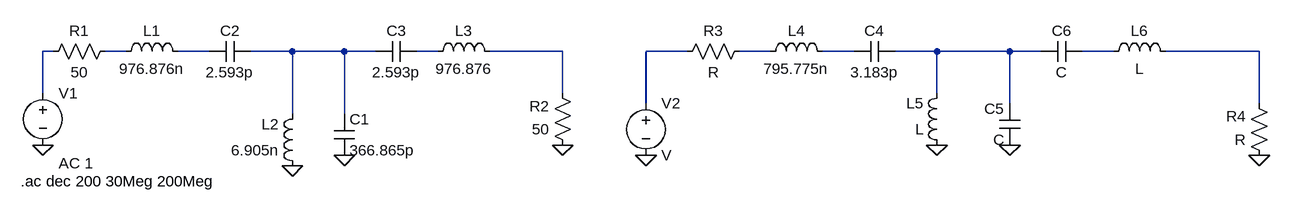
[diagram p0: schematic Draft8.asc]
Draft8.asc, the LTspice schematic file:
Version 4
SHEET 1 1748 680
WIRE -128 128 -144 128
WIRE -16 128 -48 128
WIRE 112 128 64 128
WIRE 240 128 176 128
WIRE 320 128 240 128
WIRE 368 128 320 128
WIRE 464 128 432 128
WIRE 656 128 544 128
WIRE 848 128 784 128
WIRE 976 128 928 128
WIRE 1104 128 1056 128
WIRE 1232 128 1168 128
WIRE 1344 128 1232 128
WIRE 1392 128 1344 128
WIRE 1504 128 1456 128
WIRE 1728 128 1584 128
WIRE -144 192 -144 128
WIRE 656 192 656 128
WIRE 1232 192 1232 128
WIRE 784 208 784 128
WIRE 1344 208 1344 128
WIRE 1728 208 1728 128
WIRE 240 224 240 128
WIRE 320 224 320 128
FLAG 240 304 0
FLAG 320 288 0
FLAG 656 272 0
FLAG -144 272 0
FLAG 784 288 0
FLAG 1232 272 0
FLAG 1344 272 0
FLAG 1728 288 0
SYMBOL ind -32 144 R270
WINDOW 0 32 56 VTop 2
WINDOW 3 5 56 VBottom 2
SYMATTR InstName L1
SYMATTR Value 976.876n
SYMBOL ind 256 320 R180
WINDOW 0 36 80 Left 2
WINDOW 3 36 40 Left 2
SYMATTR InstName L2
SYMATTR Value 6.905n
SYMBOL ind 448 144 R270
WINDOW 0 32 56 VTop 2
WINDOW 3 5 56 VBottom 2
SYMATTR InstName L3
SYMATTR Value 976.876
SYMBOL cap 304 224 R0
SYMATTR InstName C1
SYMATTR Value 366.865p
SYMBOL cap 176 112 R90
WINDOW 0 0 32 VBottom 2
WINDOW 3 32 32 VTop 2
SYMATTR InstName C2
SYMATTR Value 2.593p
SYMBOL cap 432 112 R90
WINDOW 0 0 32 VBottom 2
WINDOW 3 32 32 VTop 2
SYMATTR InstName C3
SYMATTR Value 2.593p
SYMBOL voltage -144 176 R0
WINDOW 123 24 124 Left 2
WINDOW 39 0 0 Left 0
SYMATTR InstName V1
SYMATTR Value ""
SYMATTR Value2 AC 1
SYMBOL res -32 112 R90
WINDOW 0 0 56 VBottom 2
WINDOW 3 32 56 VTop 2
SYMATTR InstName R1
SYMATTR Value 50
SYMBOL res 672 288 R180
WINDOW 0 36 76 Left 2
WINDOW 3 36 40 Left 2
SYMATTR InstName R2
SYMATTR Value 50
SYMBOL res 944 112 R90
WINDOW 0 0 56 VBottom 2
WINDOW 3 32 56 VTop 2
SYMATTR InstName R3
SYMBOL res 1744 304 R180
WINDOW 0 36 76 Left 2
WINDOW 3 36 40 Left 2
SYMATTR InstName R4
SYMBOL cap 1168 112 R90
WINDOW 0 0 32 VBottom 2
WINDOW 3 32 32 VTop 2
SYMATTR InstName C4
SYMATTR Value 3.183p
SYMBOL cap 1360 272 R180
WINDOW 0 24 56 Left 2
WINDOW 3 24 8 Left 2
SYMATTR InstName C5
SYMBOL cap 1392 144 R270
WINDOW 0 32 32 VTop 2
WINDOW 3 0 32 VBottom 2
SYMATTR InstName C6
SYMBOL ind 960 144 R270
WINDOW 0 32 56 VTop 2
WINDOW 3 5 56 VBottom 2
SYMATTR InstName L4
SYMATTR Value 795.775n
SYMBOL ind 1248 288 R180
WINDOW 0 36 80 Left 2
WINDOW 3 36 40 Left 2
SYMATTR InstName L5
SYMBOL ind 1488 144 R270
WINDOW 0 32 56 VTop 2
WINDOW 3 5 56 VBottom 2
SYMATTR InstName L6
SYMBOL voltage 784 192 R0
SYMATTR InstName V2
TEXT -178 328 Left 2 !.ac dec 200 30Meg 200Meg

The netlist it stands for:
* Draft8.asc
L1 N002 N003 976.876n
L2 0 N004 6.905n
L3 N005 N006 976.876
C1 N004 0 366.865p
C2 N004 N003 2.593p
C3 N005 N004 2.593p
V1 N001 0 AC 1
R1 N002 N001 50
R2 0 N006 50
R3 N008 N007 R
R4 0 N012 R
C4 N010 N009 3.183p
C5 0 N010 C
C6 N010 N011 C
L4 N008 N009 795.775n
L5 0 N010 L
L6 N011 N012 L
V2 N007 0 V
.ac dec 200 30Meg 200Meg
.backanno
.end